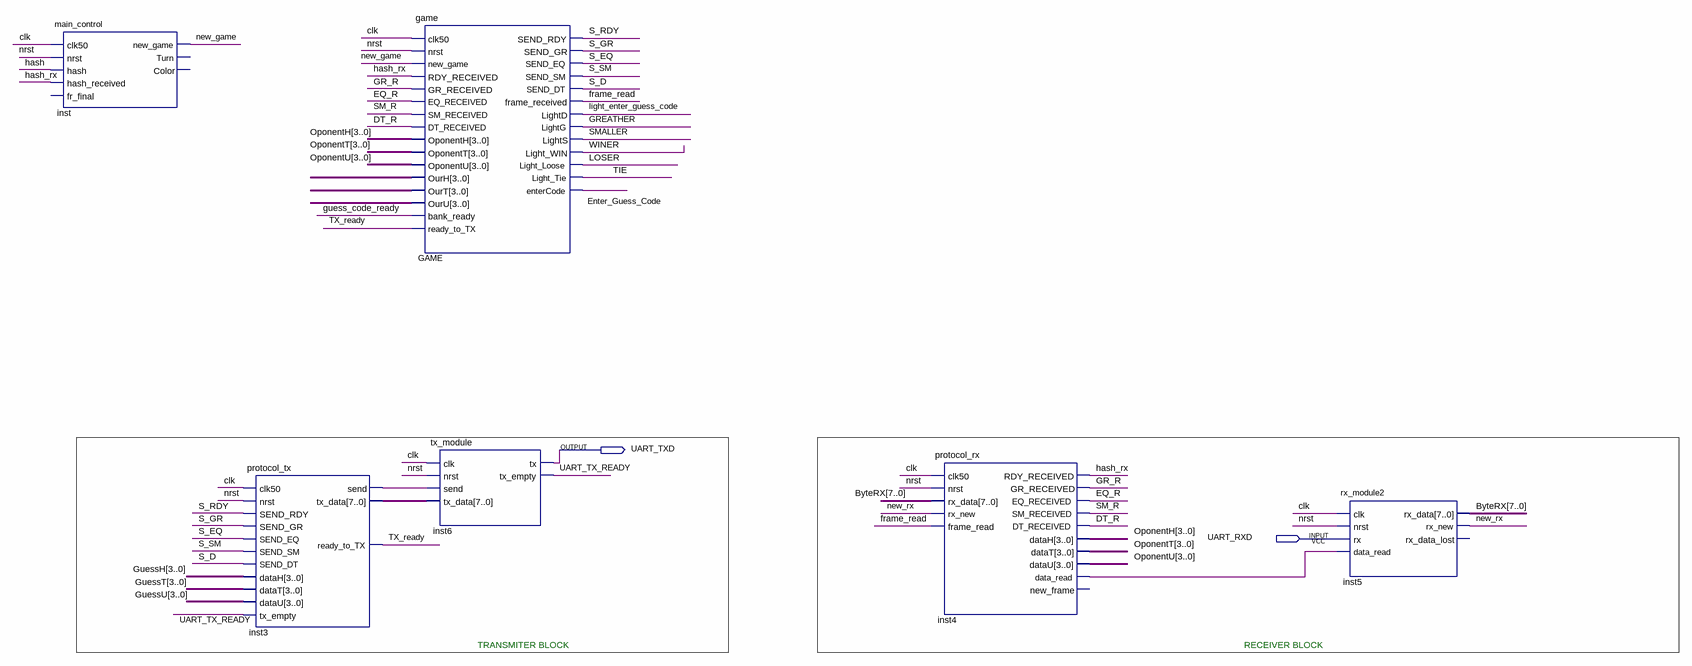
[diagram p0: schematic sheet]
// Quartus schematic sender1.bdf as structural Verilog: 6 symbols, 2 pins
module sender1 (
  input  UART_RXD,
  output UART_TXD
);

  wire clk, DT_R, Enter_Guess_Code, EQ_R, frame_read, GR_R, GREATHER, guess_code_ready, hash, hash_rx,
       inst3_send, inst4_data_read, light_enter_guess_code, LOSER, new_game, new_rx, nrst, S_D, S_EQ, S_GR,
       S_RDY, S_SM, SM_R, SMALLER, TIE, TX_ready, UART_TX_READY, WINER;
  wire [3:0] GuessH, GuessT, GuessU, OponentH, OponentT, OponentU, undriven, undriven_2, undriven_3;
  wire [7:0] ByteRX, inst3_tx_data;

  main_control inst (
    .clk50(clk), .nrst(nrst), .hash(hash), .hash_received(hash_rx), .new_game(new_game));  // open: fr_final, Turn, Color
  protocol_tx inst3 (
    .clk50(clk), .nrst(nrst), .SEND_RDY(S_RDY), .SEND_GR(S_GR), .SEND_EQ(S_EQ), .SEND_SM(S_SM),
    .SEND_DT(S_D), .dataH(GuessH), .dataT(GuessT), .dataU(GuessU), .tx_empty(UART_TX_READY),
    .tx_data(inst3_tx_data), .ready_to_TX(TX_ready), .send(inst3_send));
  game GAME (
    .clk50(clk), .nrst(nrst), .new_game(new_game), .RDY_RECEIVED(hash_rx), .GR_RECEIVED(GR_R),
    .EQ_RECEIVED(EQ_R), .SM_RECEIVED(SM_R), .DT_RECEIVED(DT_R), .OponentH(OponentH), .OponentT(OponentT),
    .OponentU(OponentU), .OurH(undriven), .OurT(undriven_2), .OurU(undriven_3),
    .bank_ready(guess_code_ready), .ready_to_TX(TX_ready), .SEND_RDY(S_RDY), .SEND_GR(S_GR), .SEND_EQ(S_EQ),
    .SEND_SM(S_SM), .SEND_DT(S_D), .frame_received(frame_read), .LightD(light_enter_guess_code),
    .LightG(GREATHER), .LightS(SMALLER), .Light_WIN(WINER), .Light_Loose(LOSER), .Light_Tie(TIE),
    .enterCode(Enter_Guess_Code));
  tx_module inst6 (
    .clk(clk), .nrst(nrst), .send(inst3_send), .tx_data(inst3_tx_data), .tx(UART_TXD),
    .tx_empty(UART_TX_READY));
  protocol_rx inst4 (
    .clk50(clk), .nrst(nrst), .rx_data(ByteRX), .rx_new(new_rx), .frame_read(frame_read),
    .RDY_RECEIVED(hash_rx), .GR_RECEIVED(GR_R), .EQ_RECEIVED(EQ_R), .SM_RECEIVED(SM_R), .DT_RECEIVED(DT_R),
    .dataH(OponentH), .dataT(OponentT), .dataU(OponentU), .data_read(inst4_data_read));  // open: new_frame
  rx_module2 inst5 (
    .clk(clk), .nrst(nrst), .rx(UART_RXD), .data_read(inst4_data_read), .rx_data(ByteRX), .rx_new(new_rx));  // open: rx_data_lost

  // Notes on the sheet:
  //   TRANSMITER BLOCK
  //   RECEIVER BLOCK
endmodule
